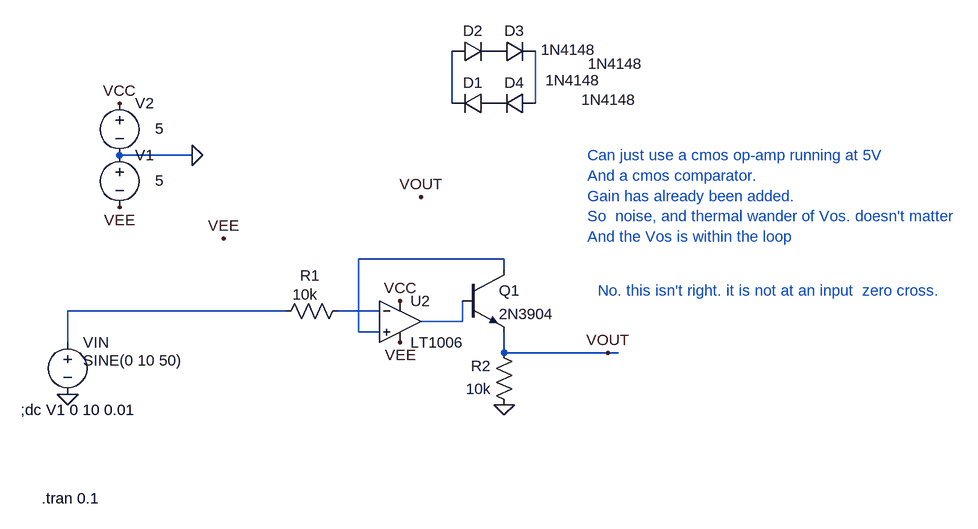
[diagram p0: schematic Draft103.asc]
Draft103.asc, the LTspice schematic file:
Version 4
SHEET 1 1316 680
WIRE 496 -240 496 -320
WIRE 624 -240 624 -320
WIRE 96 -160 -16 -160
WIRE 576 0 352 0
WIRE 576 16 576 0
WIRE 240 80 -96 80
WIRE 384 80 320 80
WIRE 512 96 512 64
WIRE 512 96 448 96
WIRE 352 112 352 0
WIRE 384 112 352 112
WIRE -96 128 -96 80
WIRE 576 144 576 112
WIRE 736 144 576 144
WIRE 752 144 736 144
FLAG -96 208 0
FLAG 96 -160 0
FLAG 448 -96 VOUT
FLAG -16 -240 VCC
FLAG 416 64 VCC
FLAG -16 -80 VEE
FLAG 416 128 VEE
FLAG 144 -32 VEE
FLAG 576 224 0
FLAG 736 144 VOUT
SYMBOL voltage -96 112 R0
WINDOW 123 0 0 Left 0
WINDOW 39 0 0 Left 0
WINDOW 3 24 44 Left 2
SYMATTR Value SINE(0 10 50)
SYMATTR InstName VIN
SYMBOL voltage -16 -256 R0
WINDOW 123 0 0 Left 0
WINDOW 39 0 0 Left 0
WINDOW 3 55 55 Left 2
SYMATTR Value 5
SYMATTR InstName V2
SYMBOL res 336 64 R90
WINDOW 0 -23 59 VBottom 2
WINDOW 3 -25 66 VTop 2
SYMATTR InstName R1
SYMATTR Value 10k
SYMBOL diode 560 -256 R90
WINDOW 0 0 32 VBottom 2
WINDOW 3 -35 -122 VTop 2
SYMATTR InstName D1
SYMATTR Value 1N4148
SYMBOL diode 496 -304 R270
WINDOW 0 32 32 VTop 2
WINDOW 3 34 179 VBottom 2
SYMATTR InstName D2
SYMATTR Value 1N4148
SYMBOL diode 560 -304 R270
WINDOW 0 32 32 VTop 2
WINDOW 3 13 187 VBottom 2
SYMATTR InstName D3
SYMATTR Value 1N4148
SYMBOL diode 624 -256 R90
WINDOW 0 0 32 VBottom 2
WINDOW 3 -5 -113 VTop 2
SYMATTR InstName D4
SYMATTR Value 1N4148
SYMBOL voltage -16 -176 R0
WINDOW 123 0 0 Left 0
WINDOW 39 0 0 Left 0
WINDOW 3 55 55 Left 2
SYMATTR Value 5
SYMATTR InstName V1
SYMBOL res 592 240 R180
WINDOW 0 36 76 Left 2
WINDOW 3 36 40 Left 2
SYMATTR InstName R2
SYMATTR Value 10k
SYMBOL OpAmps\\LT1006 416 32 R0
SYMATTR InstName U2
SYMBOL npn 512 16 R0
SYMATTR InstName Q1
SYMATTR Value 2N3904
TEXT -168 232 Left 2 !;dc V1 0 10 0.01
TEXT -136 368 Left 2 !.tran 0.1
TEXT 704 -160 Left 2 ;Can just use a cmos op-amp running at 5V\nAnd a cmos comparator.\nGain has already been added.\nSo  noise, and thermal wander of Vos. doesn't matter\nAnd the Vos is within the loop
TEXT 720 48 Left 2 ;No. this isn't right. it is not at an input  zero cross.

The netlist it stands for:
* Draft103.asc
VIN N004 0 SINE(0 10 50)
V2 VCC 0 5
R1 N005 N004 10k
D1 P001 N001 1N4148
D2 N001 P002 1N4148
D3 P002 N002 1N4148
D4 N002 P001 1N4148
V1 0 VEE 5
R2 0 VOUT 10k
XU2 N003 N005 VCC VEE N006 LT1006  ; pins In+ In- V+ V- OUT
Q1 N003 N006 VOUT 0 2N3904
.model D D
.lib standard.dio
.model NPN NPN
.model PNP PNP
.lib standard.bjt
;dc V1 0 10 0.01
.tran 0.1
* Can just use a cmos op-amp running at 5V
* And a cmos comparator.
* Gain has already been added.
* So  noise, and thermal wander of Vos. doesn't matter
* And the Vos is within the loop
* No. this isn't right. it is not at an input  zero cross.
.lib LTC.lib
.backanno
.end